# EAGLE design untitled (EAGLE 6.1)
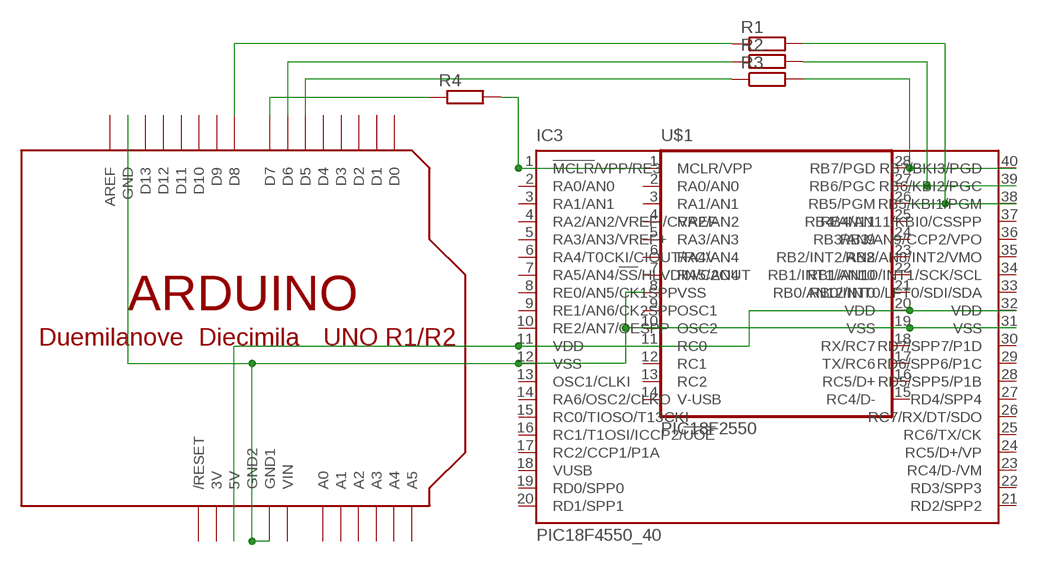
[diagram p0: schematic, sheet 1]

## Parts
IC3  PIC18F4550_40  [DIL40]
R1  R-EU_0204/7  [0204/7]
R2  R-EU_0204/7  [0204/7]
R3  R-EU_0204/7  [0204/7]
R4  R-EU_0204/7  [0204/7]
U$1  PIC18F2550  [DIL28-3]
U$2  ARDUINO-NOHOLE  [ARDUINO-NOHOLE]

## Nets
GND: IC3.12(VSS) IC3.31(VSS) U$1.8(VSS) U$1.19(VSS) U$2.GND U$2.GND1 U$2.GND2
N$1: IC3.1(!MCLR!/VPP/RE3) R4.2 U$1.1(MCLR/VPP)
N$2: IC3.40(RB7/BKI3/PGD) R3.2 U$1.28(RB7/PGD)
N$3: IC3.39(RB6/KBI2/PGC) R2.2 U$1.27(RB6/PGC)
N$4: IC3.38(RB5/KBI1/PGM) R1.2 U$1.26(RB5/PGM)
N$5: IC3.11(VDD) IC3.32(VDD) U$1.20(VDD) U$2.5V
N$7: R1.1 U$2.D8
N$8: R2.1 U$2.D6
N$9: R3.1 U$2.D5
N$10: R4.1 U$2.D7
Unconnected: IC3.2(RA0/AN0) IC3.3(RA1/AN1) IC3.4(RA2/AN2/VREF-/CVREF) IC3.5(RA3/AN3/VREF+) IC3.6(RA4/T0CKI/CIOUT/RCV) IC3.7(RA5/AN4/!SS!/HLVDIN/C2OUT) IC3.8(RE0/AN5/CK1SPP) IC3.9(RE1/AN6/CK2SPP) IC3.10(RE2/AN7/OESPP) IC3.13(OSC1/CLKI) IC3.14(RA6/OSC2/CLKO) IC3.15(RC0/TIOSO/T13CKI) IC3.16(RC1/T1OSI/ICCP2/!UOE) IC3.17(RC2/CCP1/P1A) IC3.18(VUSB) IC3.19(RD0/SPP0) IC3.20(RD1/SPP1) IC3.21(RD2/SPP2) IC3.22(RD3/SPP3) IC3.23(RC4/D-/VM) IC3.24(RC5/D+/VP) IC3.25(RC6/TX/CK) IC3.26(RC7/RX/DT/SDO) IC3.27(RD4/SPP4) IC3.28(RD5/SPP5/P1B) IC3.29(RD6/SPP6/P1C) IC3.30(RD7/SPP7/P1D) IC3.33(RB0/AN12/INT0/LFT0/SDI/SDA) IC3.34(RB1/AN10/INT1/SCK/SCL) IC3.35(RB2/AN8/INT2/VMO) IC3.36(RB3/AN9/CCP2/VPO) IC3.37(RB4/AN11/KBI0/CSSPP) U$1.2(RA0/AN0) U$1.3(RA1/AN1) U$1.4(RA2/AN2) U$1.5(RA3/AN3) U$1.6(RA4/AN4) U$1.7(RA5/AN4) U$1.9(OSC1) U$1.10(OSC2) U$1.11(RC0) U$1.12(RC1) U$1.13(RC2) U$1.14(V-USB) U$1.15(RC4/D-) U$1.16(RC5/D+) U$1.17(TX/RC6) U$1.18(RX/RC7) U$1.21(RB0/INT0) U$1.22(RB1/INT1/AN10) U$1.23(RB2/INT2/AN8) U$1.24(RB3/AN9) U$1.25(RB4/AN11) U$2.A0 U$2.A1 U$2.A2 U$2.A3 U$2.A4 U$2.A5 U$2.AREF U$2.D0 U$2.D1 U$2.D2 U$2.D3 U$2.D4 U$2.D9 U$2.D10 U$2.D11 U$2.D12 U$2.D13 U$2.RESET(/RESET)

## Power pins joined to a net without a drawn wire
3V: U$2.3V
VIN: U$2.VIN

## Library data of the parts
IC3 = microchip:PIC18F4*_40: USB Microcontrollers with nanoWatt Technology High-Performance, Enhanced Flash, 28/40/44-Pin, Source: http://ww1.microchip.com/downloads/en/devicedoc/39632c.pdf; MF: MICROCHIP; MPN: PIC18F4550-I/P; OC_FARNELL: 9321357; OC_NEWARK: 74K8623
R1-R4 = rcl:R-EU_: RESISTOR, European symbol
U$1 = SparkFun:PIC18F2550
U$2 = adafruit:ARDUINO: Arduino Diecimila/Duemilanove Make a shield with ease, this package has all the named pins as well as the two mounting drill holes and an outline of the USB and DC power connector. The outline is on the DIMENSION layer, so if your board house uses it they will cut the outline to match. http://www.ladyada.net/library/pcb/eaglelibrary.html

## Board
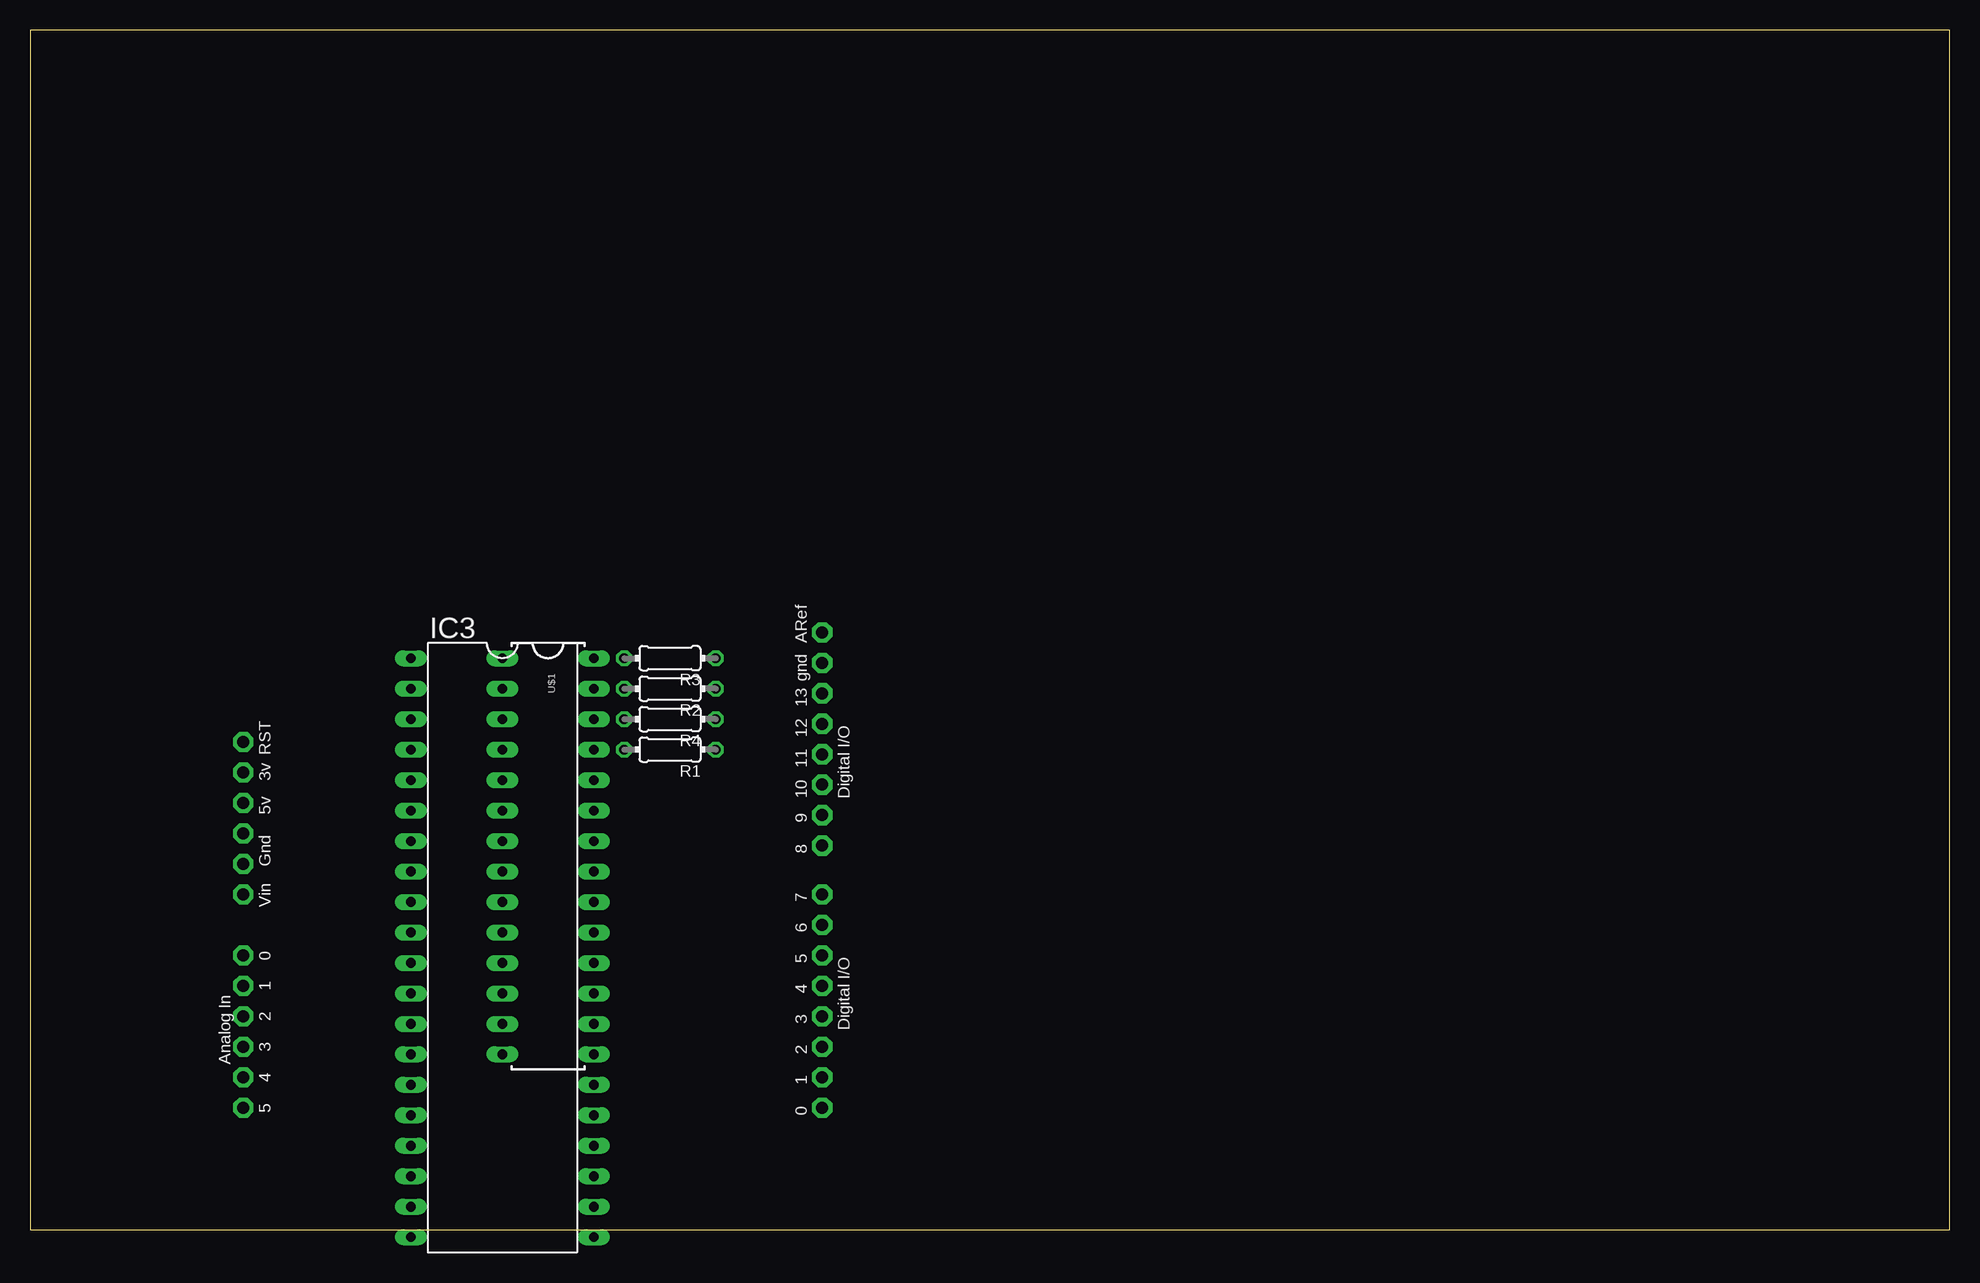
[diagram p1: board, top side]
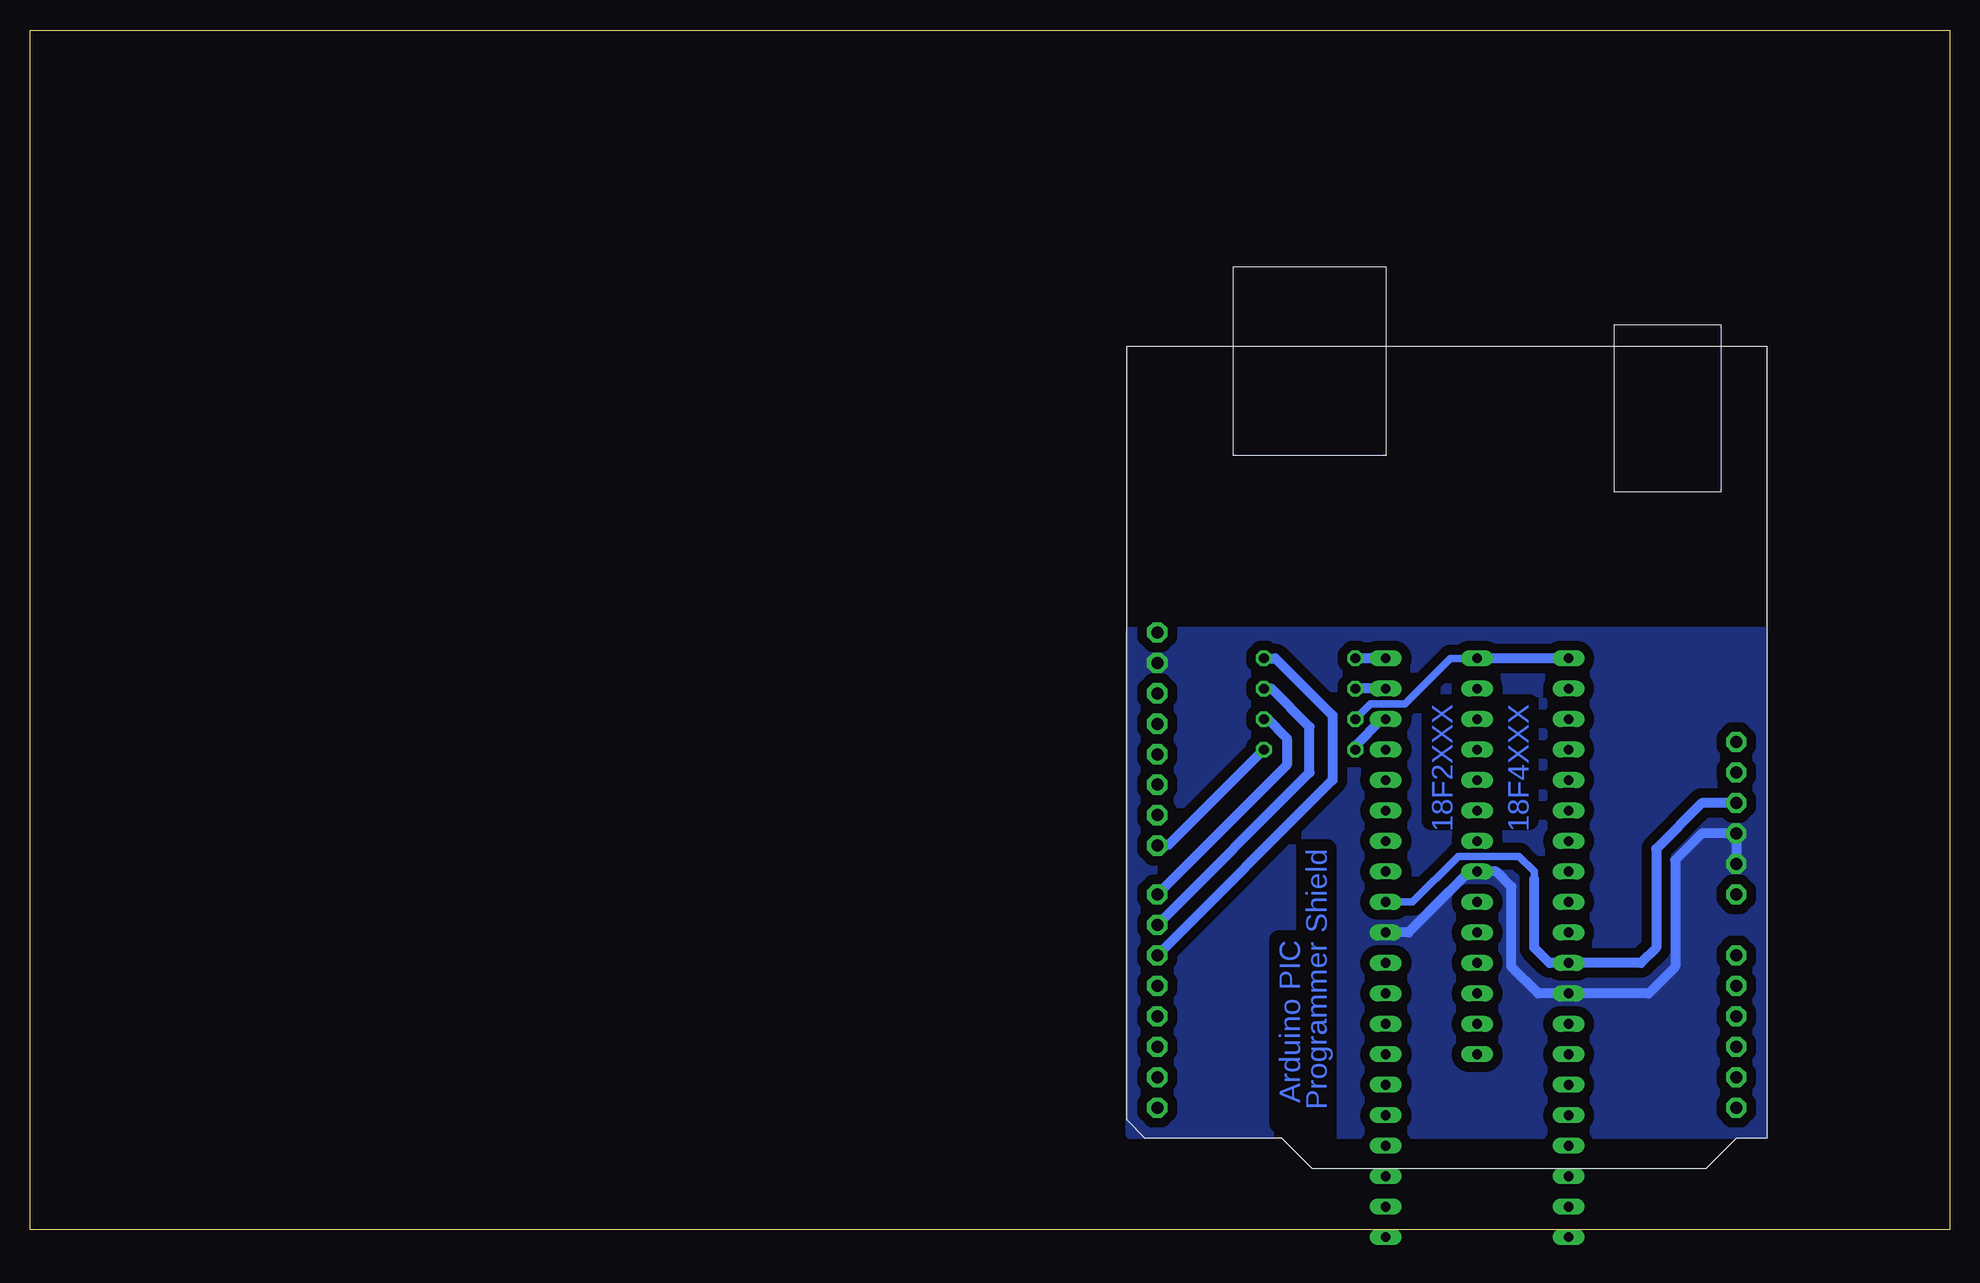
[diagram p2: board, bottom side, seen from below]

Size 160 x 100 mm. Coordinates in mm from the lower left corner, seen from the top.
Outline: 0,0 160,0 160,100 0,100 0,0
Copper layers (1*16): Top 0.035mm / dielectric 1.5mm / Bottom 0.035mm
Design rules: minimum track width 10mil, minimum drill 24mil, track to track 8mil, track to pad 8mil, pad to pad 8mil, via to via 8mil, smd to smd 8mil, copper to edge 40mil, drill to drill 8mil, minimum pad ring 10mil, minimum via ring 8mil, stop-mask expansion 4mil, vias tented up to drill 0mil, thermal gap 10mil

### Footprints (pad centres in the part's own frame; a part is rotated, then mirrored left to right if it is on the bottom)
DIL40 = drill 0.813 long: 1 -24.13,-7.62; 2 -21.59,-7.62; 3 -19.05,-7.62; 4 -16.51,-7.62; 5 -13.97,-7.62; 6 -11.43,-7.62; 7 -8.89,-7.62; 8 -6.35,-7.62; 9 -3.81,-7.62; 10 -1.27,-7.62; 11 1.27,-7.62; 12 3.81,-7.62; 13 6.35,-7.62; 14 8.89,-7.62; 15 11.43,-7.62; 16 13.97,-7.62; 17 16.51,-7.62; 18 19.05,-7.62; 19 21.59,-7.62; 20 24.13,-7.62; 21 24.13,7.62; 22 21.59,7.62; 23 19.05,7.62; 24 16.51,7.62; 25 13.97,7.62; 26 11.43,7.62; 27 8.89,7.62; 28 6.35,7.62; 29 3.81,7.62; 30 1.27,7.62; 31 -1.27,7.62; 32 -3.81,7.62; 33 -6.35,7.62; 34 -8.89,7.62; 35 -11.43,7.62; 36 -13.97,7.62; 37 -16.51,7.62; 38 -19.05,7.62; 39 -21.59,7.62; 40 -24.13,7.62
0204/7 = drill 0.813 octagon: 1 -3.81,0; 2 3.81,0
DIL28-3 = drill 0.813 long: 1 -16.51,-3.81; 2 -13.97,-3.81; 3 -11.43,-3.81; 4 -8.89,-3.81; 5 -6.35,-3.81; 6 -3.81,-3.81; 7 -1.27,-3.81; 8 1.27,-3.81; 9 3.81,-3.81; 10 6.35,-3.81; 11 8.89,-3.81; 12 11.43,-3.81; 13 13.97,-3.81; 14 16.51,-3.81; 15 16.51,3.81; 16 13.97,3.81; 17 11.43,3.81; 18 8.89,3.81; 19 6.35,3.81; 20 3.81,3.81; 21 1.27,3.81; 22 -1.27,3.81; 23 -3.81,3.81; 24 -6.35,3.81; 25 -8.89,3.81; 26 -11.43,3.81; 27 -13.97,3.81; 28 -16.51,3.81
ARDUINO-NOHOLE = drill 1 pad 1.676 octagon: 3V 35.56,2.54; 5V 38.1,2.54; A0 50.8,2.54; A1 53.34,2.54; A2 55.88,2.54; A3 58.42,2.54; A4 60.96,2.54; A5 63.5,2.54; AREF 23.876,50.8; D0 63.5,50.8; D1 60.96,50.8; D2 58.42,50.8; D3 55.88,50.8; D4 53.34,50.8; D5 50.8,50.8; D6 48.26,50.8; D7 45.72,50.8; D8 41.656,50.8; D9 39.116,50.8; D10 36.576,50.8; D11 34.036,50.8; D12 31.496,50.8; D13 28.956,50.8; GND 26.416,50.8; GND1 43.18,2.54; GND2 40.64,2.54; RESET 33.02,2.54; VIN 45.72,2.54

### Placement (x,y rotation side)
IC3  39.37,23.5 270 top
R1  53.34,40.01 180 top
R2  53.34,45.09 180 top
R3  53.34,47.62 180 top
R4  53.34,42.55 180 top
U$1  43.18,31.11 270 top
U$2  15.24,73.66 270 top

### Tracks (layer width: path | path; a pad name or v marks a point on that pad's centre or on a via)
GND
  Bottom 0.813: U$1.19 45.09,24.77 40.01,29.84 U$1.8 37.78,29.84 36.51,28.57 36.51,21.91 34.29,19.68 IC3.12 25.08,19.68 22.86,21.91 22.86,30.8 20.64,33.02 U$2.GND2 U$2.GND1
  pour Bottom (isolate 0.813, no thermals): 15.56,7.94 68.26,7.94 68.26,49.85 15.56,49.85
N$1
  Bottom 0.61: U$1.1 41.59,47.62 45.4,43.81 48.26,43.81 R4.2
  Bottom 0.813: IC3.1 U$1.1
N$2
  Bottom 0.813: IC3.40 R3.2
N$3
  Bottom 0.813: U$1.27 R2.2
N$4
  Bottom 0.813: R1.2 49.53,40.32 47.31,42.55 IC3.38
N$5
  Bottom 0.61: 34.61,29.21 34.61,29.84 35.88,31.11 40.96,31.11 44.77,27.3 IC3.32
  Bottom 0.813: 34.61,29.21 34.61,23.5 33.34,22.23 IC3.11 25.72,22.23 24.45,23.5 24.45,31.75 20.64,35.56 U$2.5V
N$7
  Bottom 0.813: U$2.D8 65.98,32.07 65.09,32.07 R1.1
N$8
  Bottom 0.813: U$2.D6 53.34,38.1 53.34,41.91 56.52,45.09 R2.1
N$9
  Bottom 0.813: U$2.D5 51.44,37.47 51.44,42.86 56.2,47.62 R3.1
N$10
  Bottom 0.813: U$2.D7 55.24,38.73 55.24,40.96 56.83,42.55 R4.1

### Text on the board
Bottom: 18F4XXX | 18F2XXX | Programmer Shield | Arduino PIC